# Altium schematic sheet 800U-R3N3-Test.SchDoc
size Letter
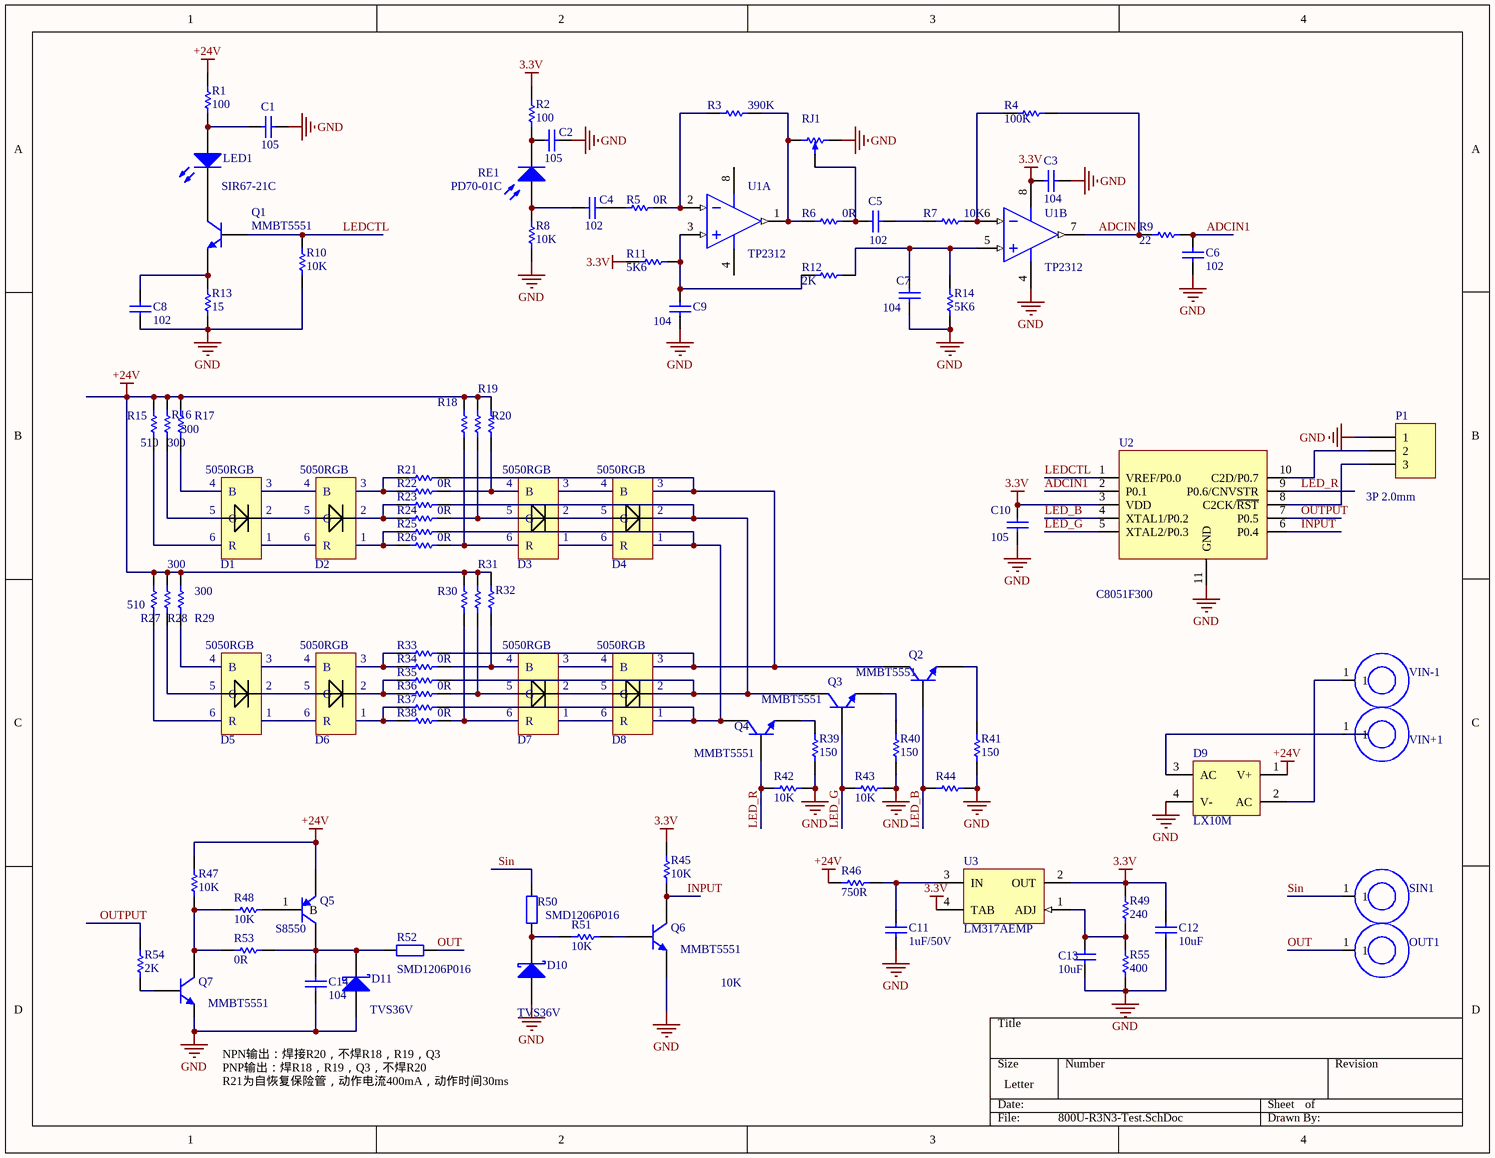
[diagram p0: 800U-R3N3-Test.SchDoc]

## Parts
C1  105  [C0805]
C2  105  [C0603]
C3  104  [C0603]
C4  102  [C0603]
C5  102  [C0603]
C6  102  [C0603]
C7  104  [C0603]
C8  102  [C0603]
C9  104  [C0603]
C10  105  [C0603]
C11  1uF/50V  [C0603]
C12  10uF  [C0603]
C13  10uF  [C0603]
C14  104  [C0603]
D1  5050RGB  [5050RGB]
D2  5050RGB  [5050RGB]
D3  5050RGB  [5050RGB]
D4  5050RGB  [5050RGB]
D5  5050RGB  [5050RGB]
D6  5050RGB  [5050RGB]
D7  5050RGB  [5050RGB]
D8  5050RGB  [5050RGB]
D9  LX10M  [桥堆 3.8*3.5]
D10  TVS36V  [D1206]
D11  TVS36V  [D1206]
LED1  SIR67-21C  [LED-3.5X2.8]
OUT1  (no value)  [HOLE_SMD]
P1  3P 2.0mm  [PIN3-2.0mm]
Q1  MMBT5551  [SOT-23]
Q2  MMBT5551  [SOT-23]
Q3  MMBT5551  [SOT-23]
Q4  MMBT5551  [SOT-23]
Q5  S8550  [SOT-23]
Q6  MMBT5551  [SOT-23]
Q7  value MMBT5551  [SOT-23]  (hidden comment: 贴片三极管)
R1  100  [R0805]
R2  100  [R0603]
R3  390K  [R0603]
R4  100K  [R0603]
R5  0R  [R0603]
R6  0R  [R0603]
R7  10K  [R0603]
R8  10K  [R0603]
R9  22  [R0603]
R10  10K  [R0603]
R11  5K6  [R0603]
R12  2K  [R0603]
R13  15  [R0805]
R14  5K6  [R0603]
R15  510  [2010]
R16  300  [2010]
R17  300  [2010]
R18  (no value)  [2010]
R19  (no value)  [2010]
R20  (no value)  [2010]
R21  (no value)  [R0603]
R22  0R  [R0603]
R23  (no value)  [R0603]
R24  0R  [R0603]
R25  (no value)  [R0603]
R26  0R  [R0603]
R27  510  [2010]
R28  300  [2010]
R29  300  [2010]
R30  (no value)  [2010]
R31  (no value)  [2010]
R32  (no value)  [2010]
R33  (no value)  [R0603]
R34  0R  [R0603]
R35  (no value)  [R0603]
R36  0R  [R0603]
R37  (no value)  [R0603]
R38  0R  [R0603]
R39  150  [2010]
R40  150  [2010]
R41  150  [2010]
R42  10K  [R0603]
R43  10K  [R0603]
R44  10K  [R0603]
R45  10K  [R0603]
R46  750R  [2010]
R47  10K  [R0603]
R48  10K  [R0603]
R49  240  [R0603]
R50  SMD1206P016  [1206]
R51  10K  [R0603]
R52  SMD1206P016  [1206]
R53  0R  [R0603]
R54  2K  [R0603]
R55  400  [R0603]
RE1  PD70-01C  [LED-1210]
RJ1  (no value)  [POT4MM-2]
SIN1  (no value)  [HOLE_SMD]
U1  TP2312  [SO-8]  (parts A,B of 2)
U2  C8051F300  [IC3-3-14P]
U3  LM317AEMP  [MP04A_N]
VIN+1  (no value)  [HOLE_SMD]
VIN-1  (no value)  [HOLE_SMD]

## Nets
3.3V: C3.1 C10.1 C12.1 R2.2 R11.1 R45.2 R49.2 U1.8(VCC) U2.3(VDD) U3.2(OUT) U3.4(TAB)
+24V: D9.1(V+) Q5.2(E) R1.2 R15.1 R16.1 R17.1 R18.1 R19.1 R20.1 R27.1 R28.1 R29.1 R30.1 R31.1 R32.1 R46.1 R47.2
GND: C1.2 C2.2 C3.2 C6.1 C7.2 C8.2 C9.2 C10.2 C11.2 C12.2 C13.2 C14.2 D9.4(V-) D10.1(A) D11.1(A) P1.1 Q6.2(E) Q7.2(E) R8.1 R10.1 R13.1 R14.1 R39.2 R40.2 R41.2 R42.2 R43.2 R44.2 R55.1 RJ1.CW(+) U1.4(VEE) U2.11(GND)
ADCIN: R4.2 R9.1 U1.7(OUT)
ADCIN1: C6.2 R9.2 U2.2(P0.1)
INPUT: Q6.3(C) R45.1 U2.6(P0.4)
LED_B: Q2.1(B) R44.1 U2.4(XTAL1/P0.2)
LED_G: Q3.1(B) R43.1 U2.5(XTAL2/P0.3)
LED_R: Q4.1(B) R42.1 U2.9(P0.6/CNVSTR)
LEDCTL: Q1.1(B) R10.2 U2.1(VREF/P0.0)
OUT: OUT1.1 R52.2
OUTPUT: R54.2 U2.7(P0.5)
Sin: R50.2 SIN1.1
NetC1_1: C1.1 LED1.1(A) R1.1
NetC2_1: C2.1 R2.1 RE1.2(K)
NetC4_1: C4.1 R8.2 RE1.1(A)
NetC4_2: C4.2 R5.1
NetC5_1: C5.1 R6.2 RJ1.W
NetC5_2: C5.2 R7.1
NetC7_1: C7.1 R12.2 R14.2 U1.5(IN+)
NetC8_1: C8.1 Q1.2(E) R13.2
NetC9_1: C9.1 R11.2 R12.1 U1.3(IN+)
NetC11_1: C11.1 R46.2 U3.3(IN)
NetC13_1: C13.1 R49.1 R55.2 U3.1(ADJ)
NetC14_1: C14.1 D11.2(K) Q5.3(C) R52.1 R53.2
NetD1_1: D1.1 D2.6(R)
NetD1_2: D1.2 D2.5(G)
NetD1_3: D1.3 D2.4(B)
NetD1_4: D1.4(B) R17.2
NetD1_5: D1.5(G) R16.2
NetD1_6: D1.6(R) R15.2
NetD2_1: D2.1 R25.1 R26.1
NetD2_2: D2.2 R23.1 R24.1
NetD2_3: D2.3 R21.1 R22.1
NetD3_1: D3.1 D4.6(R)
NetD3_2: D3.2 D4.5(G)
NetD3_3: D3.3 D4.4(B)
NetD3_4: D3.4(B) R20.2 R22.2
NetD3_5: D3.5(G) R19.2 R24.2
NetD3_6: D3.6(R) R18.2 R26.2
NetD4_1: D4.1 D8.1 Q4.3(C) R25.2 R37.2
NetD4_2: D4.2 D8.2 Q3.3(C) R23.2 R35.2
NetD4_3: D4.3 D8.3 Q2.3(C) R21.2 R33.2
NetD5_1: D5.1 D6.6(R)
NetD5_2: D5.2 D6.5(G)
NetD5_3: D5.3 D6.4(B)
NetD5_4: D5.4(B) R29.2
NetD5_5: D5.5(G) R28.2
NetD5_6: D5.6(R) R27.2
NetD6_1: D6.1 R37.1 R38.1
NetD6_2: D6.2 R35.1 R36.1
NetD6_3: D6.3 R33.1 R34.1
NetD7_1: D7.1 D8.6(R)
NetD7_2: D7.2 D8.5(G)
NetD7_3: D7.3 D8.4(B)
NetD7_4: D7.4(B) R32.2 R34.2
NetD7_5: D7.5(G) R31.2 R36.2
NetD7_6: D7.6(R) R30.2 R38.2
NetD9_2: D9.2(AC) VIN-1.1
NetD9_3: D9.3(AC) VIN+1.1
NetD10_2: D10.2(K) R50.1 R51.1
NetLED1_2: LED1.2(K) Q1.3(C)
NetP1_2: P1.2 U2.10(C2D/P0.7)
NetP1_3: P1.3 U2.8(C2CK/~{RST})
NetQ2_2: Q2.2(E) R41.1
NetQ3_2: Q3.2(E) R40.1
NetQ4_2: Q4.2(E) R39.1
NetQ5_1: Q5.1(B) R48.2
NetQ6_1: Q6.1(B) R51.2
NetQ7_1: Q7.1(B) R54.1
NetQ7_3: Q7.3(C) R47.1 R48.1 R53.1
NetR3_1: R3.1 R5.2 U1.2(IN-)
NetR3_2: R3.2 R6.1 RJ1.CCW(-) U1.1(OUT)
NetR4_1: R4.1 R7.2 U1.6(IN-)

## Notes on the sheet
- NPN输出：焊接R20，不焊R18，R19，Q3
  PNP输出：焊R18，R19，Q3，不焊R20
  R21为自恢复保险管，动作电流400mA，动作时间30ms

## Library data of the parts
C1-C14 = Cap: 贴片电容; Published: 8-Jun-2000; LatestRevisionDate: 17-Jul-2002; LatestRevisionNote: Re-released for DXP Platform.; PackageReference: RAD-0.3; Publisher: Altium Limited
  C1 C2 C10: Value: 105
  C3 C7 C9 C14: Value: 104
  C4-C6 C8: Value: 102
  C11: PackageDescription: Radial Cap, Thru-Hole; 2 Leads; 0.3 in Pin Spacing; Value: 1uF/50V
  C12 C13: PackageDescription: Radial Cap, Thru-Hole; 2 Leads; 0.3 in Pin Spacing; Value: 10uF
D1-D8 = 5050RGB: 贴片RBG发光管; Value: 5050RGB
D9 = Bridge2: 贴片桥堆; Value: LX10M
D10 D11 = D Schottky: 贴片TVS; Published: 8-Jun-2000; LatestRevisionDate: 17-Jul-2002; LatestRevisionNote: Re-released for DXP Platform.; PackageReference: SMB; Publisher: Altium Limited; Code_JEDEC: DO-214-AA; Value: TVS36V
LED1 = LED0: 贴片红外发射管; Published: 8-Jun-2000; LatestRevisionDate: 08-Jul-2005; LatestRevisionNote: Mech Layer 1 removed.; PackageReference: LED-0; Publisher: Altium Limited; Value: SIR67-21C
OUT1 SIN1 VIN+1 VIN-1 = HOLE: PCB DECAL: HOLE_SMD
P1 = MHDR1X3: 插座; LatestRevisionDate: 17-Jul-2002; LatestRevisionNote: Re-released for DXP Platform.; Publisher: Altium Limited; Value: 3P 2.0mm
Q1-Q4 Q6 = NPN: 贴片NPN三极管; Value: MMBT5551
Q5 = S8550: 贴片PNP三极管; Value: S8550
Q7 = NPN: NPN三极管
R1-R49 R51 R53-R55 = Res Semi: 贴片电阻
  R1 R2: Value: 100
  R3: Value: 390K
  R4: Value: 100K
  R5 R6 R22 R24 R26 R34 R36 R38 R53: Value: 0R
  R7 R8 R10 R42-R45 R47 R48 R51: Value: 10K
  R9: Value: 22
  R11 R14: Value: 5K6
  R12 R54: Value: 2K
  R13: Value: 15
  R15 R27: Value: 510
  R16 R17 R28 R29: Value: 300
  R39-R41: Value: 150
  R46: Value: 750R
  R49: Value: 240
  R55: Value: 400
R50 R52 = Res2: 贴片过流保护; Published: 8-Jun-2000; LatestRevisionDate: 17-Jul-2002; LatestRevisionNote: Re-released for DXP Platform.; PackageReference: AXIAL-0.4; Publisher: Altium Limited; Value: SMD1206P016
RE1 = Photo Sen: 贴片接收管; Published: 24-Mar-1999; LatestRevisionDate: 17-Jul-2002; LatestRevisionNote: Re-released for DXP Platform.; PackageReference: PIN2; Publisher: Altium Limited; Value: PD70-01C
RJ1 = RPot SM: 贴片可调电阻; Value: 20K; Published: 17-Dec-2003; DatasheetDocument: Oct-2003; PackageReference: POT4MM-2; Publisher: Altium Limited; ComponentLink1Description: Manufacturer Link; ComponentLink1URL: http://bourns.com/2/search.html
U1 = LM833D: 贴片芯片; Published: 17-Jul-2002; LatestRevisionDate: 13-Apr-2006; LatestRevisionNote: IPC-7351 Footprint Added.; DatasheetVersion: 1996; PackageVersion: 1996; PackageReference: 751-05; Publisher: Altium Limited; PackageDescription: 8-Pin Small Outline Integrated Circuit 1.27 mm Pitch; Code_JEDEC: MS-012-AA; Code_IPC: SOIC127P600-8; ComponentLink1Description: Datasheet; ComponentLink1URL: http://www.onsemi.com/pub/Collateral/LM833-D.PDF; Value: TP2312
U2 = PIC16C505: 贴片芯片; Value: C8051F300
U3 = LM317AEMP: 贴片芯片; Manufacturer: National Semiconductor; CompType: LDO IC; PackageTopMarking: XYTT*N07A; PowerWise: N; Published: 4-Dec-2008; DatasheetVersion: Apr-2007; PackageVersion: revB, Apr-2003; PackageReference: MP04A; Publisher: Altium Limited; PackageDescription: Molded SOT-223, 6.50 x 3.56 x 1.6mm Body, 4 Lead, 2.3mm Pitch; RoHS: O; PinCount: 4; DigiKeyPartNumber: LM317AEMPCT-ND; Code_JEDEC: TO-261-AA; Code_IPC: SOT223-4; ComponentLink1Description: LM317 Datasheet; ComponentLink1URL: http://www.national.com/ds/LM/LM317.pdf; ComponentLink2Description: LM317 Web Page; ComponentLink2URL: http://www.national.com/pf/LM/LM317.html; ComponentLink3Description: MP04A Package Page; ComponentLink3URL: http://www.national.com/packaging/folders/mp04a.html; Value: LM317AEMP